# Altium schematic sheet stab.SchDoc
size A4
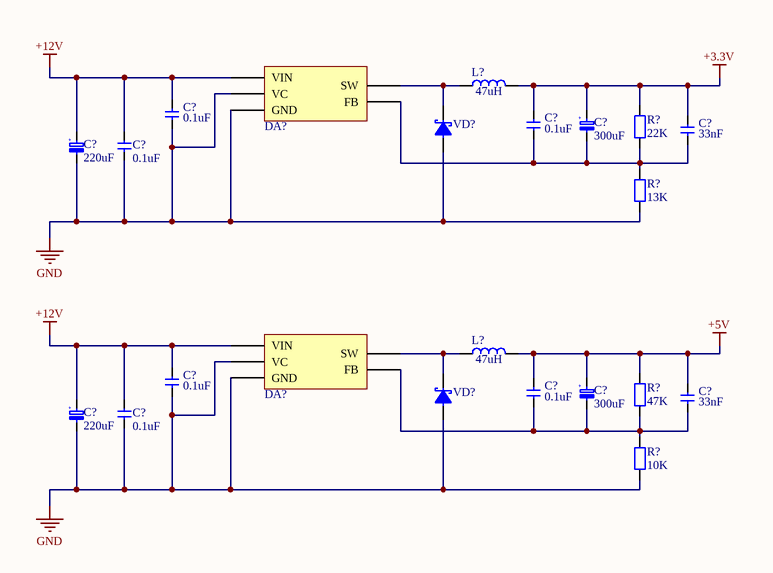
[diagram p0: stab.SchDoc]

## Parts
(Parts that share a designator on the sheet are numbered #1, #2 ... from top to bottom, then left to right.)
C?#1  0.1uF  [CAP0805]
C?#2  0.1uF  [CAP0805]
C?#3  300uF  [D8C3.2H12]
C?#4  33nF  [CAP0805]
C?#5  220uF  [D8C3.2H12]
C?#6  0.1uF  [CAP0805]
C?#7  0.1uF  [CAP0805]
C?#8  0.1uF  [CAP0805]
C?#9  300uF  [D8C3.2H12]
C?#10  33nF  [CAP0805]
C?#11  220uF  [D8C3.2H12]
C?#12  0.1uF  [CAP0805]
DA?#1  XL4015  (value not drawn)
DA?#2  XL4015  (value not drawn)
L?#1  47uH  [VLS3012HBX]
L?#2  47uH  [VLS3012HBX]
R?#1  22K  [RES0805]
R?#2  13K  [RES0805]
R?#3  47K  [RES0805]
R?#4  10K  [RES0805]
VD?#1  Diode Schottky  [DO-214AC]  (value not drawn)
VD?#2  Diode Schottky  [DO-214AC]  (value not drawn)

## Nets
+3.3V: C?#2.2 C?#3.1(PLUS) C?#4.2 L?#1.2 R?#1.2
+5V: C?#8.2 C?#9.1(PLUS) C?#10.2 L?#2.2 R?#3.2
+12V: C?#1.2 C?#5.1(PLUS) C?#6.2 C?#7.2 C?#11.1(PLUS) C?#12.2 DA?#1.5(VIN) DA?#2.5(VIN)
GND: C?#1.1 C?#5.2(MINUS) C?#6.1 C?#7.1 C?#11.2(MINUS) C?#12.1 DA?#1.1(GND) DA?#1.4(VC) DA?#2.1(GND) DA?#2.4(VC) R?#2.1 R?#4.1 VD?#1.2(A) VD?#2.2(A)
NetC?#2_1: C?#2.1 C?#3.2(MINUS) C?#4.1 DA?#1.2(FB) R?#1.1 R?#2.2
NetC?#8_1: C?#8.1 C?#9.2(MINUS) C?#10.1 DA?#2.2(FB) R?#3.1 R?#4.2
NetDA?#1_3: DA?#1.3(SW) L?#1.1 VD?#1.1(K)
NetDA?#2_3: DA?#2.3(SW) L?#2.1 VD?#2.1(K)

## Notes on the sheet
- (in symbol Cap Aluminum) +

## Library data of the parts
C?#1 C?#2 C?#4 C?#6-C?#8 C?#10 C?#12 = CAP Ceramic: Ceramic SMD Cap
C?#3 C?#9 = Cap Aluminum: 25V
C?#5 C?#11 = Cap Aluminum: 50V
DA?#1 = XL4015: 3.3V
DA?#2 = XL4015: 5V
L?#1 L?#2 = Inductor: 5A
R?#1-R?#4 = RES: RES smd